# Altium project PCB_Project1.PrjPCB (part 2 of 2)

## Sheet Ctrol2.SchDoc
size A4
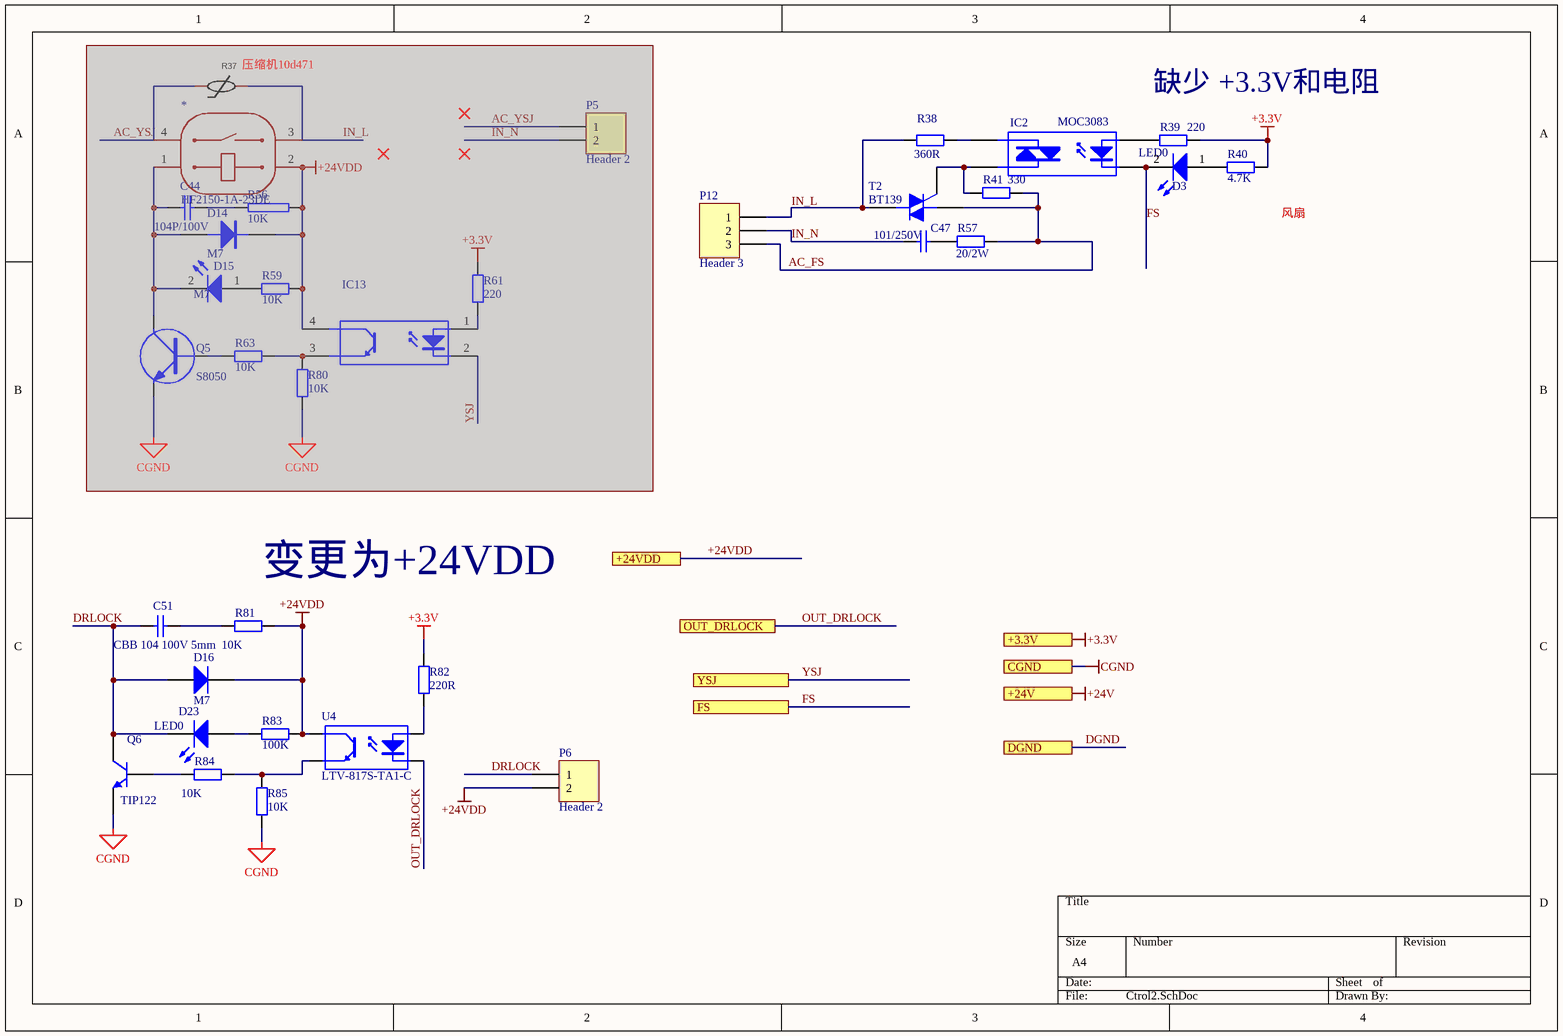
[diagram p14: Ctrol2.SchDoc]

### Parts
*  HF2150-1A-23DE  [JIDIANQI]  (masked out: inside a compile mask, not in the netlist)
C44  104P/100V  [CP1]  (masked out: inside a compile mask, not in the netlist)
C47  101/250V  [C6-7.62]
C51  CBB 104 100V 5mm  [CP1]
D3  LED0  [0805LED]
D14  M7  [SK24]  (masked out: inside a compile mask, not in the netlist)
D15  M7  [0805LED]  (masked out: inside a compile mask, not in the netlist)
D16  M7  [DO-214AC]
D23  LED0  [0805LED]
IC2  MOC3083  [DIP6]
IC13  (no value)  [TLV-356]  (masked out: inside a compile mask, not in the netlist)
P5  Header 2  [2P]  (masked out: inside a compile mask, not in the netlist)
P6  Header 2  [2P]
P12  Header 3  [CONN-TH_KF7.62-3p]
Q5  S8050  [SOT23]  (masked out: inside a compile mask, not in the netlist)
Q6  TIP122  [TO-220-AB]
R37  RM10D471KD14E100  [YAMINGDIANZU]  (value not drawn)  (masked out: inside a compile mask, not in the netlist)
R38  360R  [AXIAL0.4]
R39  220  [0805R]
R40  4.7K  [0805R]
R41  330  [AXIAL0.4]
R56  10K  [AXIAL0.4]  (masked out: inside a compile mask, not in the netlist)
R57  20/2W  [AXIAL0.6]
R59  10K  [0805R]  (masked out: inside a compile mask, not in the netlist)
R61  220  [0805R]  (masked out: inside a compile mask, not in the netlist)
R63  10K  [0805R]  (masked out: inside a compile mask, not in the netlist)
R80  10K  [0805R]  (masked out: inside a compile mask, not in the netlist)
R81  value 10K  [AXIAL0.4]  (hidden comment: 10K  1/2W)
R82  220R  [0805R]
R83  100K  [0805R]
R84  10K  [0805R]
R85  10K  [0805R]
T2  BT139  [TO220E]
U4  LTV-817S-TA1-C  [suo]

### Ports
+3.3V, +24V, +24VDD, CGND, DGND, FS, OUT_DRLOCK, YSJ

### Nets
+3.3V: R39.1 R40.2 R82.1 ; port +3.3V
+24VDD: D16.2(K) P6.2 R81.2 R83.1 U4.4(C) ; port +24VDD
CGND: Q6.3(E) R85.2 ; port CGND
AC_FS: P12.3 R41.2 R57.2 T2.1(M1)
DRLOCK: C51.2 D16.1(A) D23.2(K) P6.1 Q6.2(C)
FS: D3.2(K) IC2.2(K) ; port FS
IN_L: P12.1 R38.1 T2.2(M2)
IN_N: C47.1 P12.2
OUT_DRLOCK: U4.2(K) ; port OUT_DRLOCK
NetC47_2: C47.2 R57.1
NetC51_1: C51.1 R81.1
NetD3_1: D3.1(A) R40.1
NetD23_1: D23.1(A) R83.2
NetIC2_1: IC2.1(A) R39.2
NetIC2_4: IC2.4(A/K) R41.1 T2.3(G)
NetIC2_6: IC2.6(A/K) R38.2
NetQ6_1: Q6.1(B) R84.1
NetR82_2: R82.2 U4.1(A)
NetR84_2: R84.2 R85.1 U4.3(E)

### Notes on the sheet
- (near R37) 压缩机10d471
- 缺少 +3.3V和电阻
- (near R40) 风扇
- (near R81) 变更为+24VDD

### Library data of the parts
C44 = CAP: Capacitor
C47 = CAP: 品牌： SHM(南方宏明) 型号： DCF101K26Y5PQ6BL7A0 等级：X1,Y2 容值：100pF 精度：±10% 电压(AC)：250V；400V 安规瓷介电容器 Y2 101 ±10% Y2 250VAC；100pF；±10%；Y5P；D=6.8max；CP线 0.55mm；引脚长20min.mm；直脚/直引线；引线间距7.5mm; Manufacturer: Generic Components; Class: Passive; SubClass: Capacitor; Published: 08/06/2000; Publisher: Altium Hobart Technology Centre
C51 = Cap: Capacitor; Published: 8-Jun-2000; LatestRevisionDate: 17-Jul-2002; LatestRevisionNote: Re-released for DXP Platform.; PackageReference: RAD-0.3; Publisher: Altium Limited; PackageDescription: Radial Cap, Thru-Hole; 2 Leads; 0.3 in Pin Spacing; Value: CBB 104 100V 5mm
D3 = LED1: 品牌： 国星光电 型号： NCD0805B2 发光颜色：蓝灯 贴片LED；0805蓝色；2012蓝色；透镜颜色：无色透明；发光角度：130°；功率：72mW；工作温度：-30℃~+85℃；; Manufacturer: Generic Components; Class: Optoelectronic; SubClass: LED; Published: 08/06/2000; Publisher: Altium Hobart Technology Centre
D14 = DIODE
D15 = LED1: Typical RED GaAs LED; Manufacturer: Generic Components; Class: Optoelectronic; Published: 08/06/2000; Publisher: Altium Hobart Technology Centre; SubClass: LED
D16 = Diode 1N4004: 1 Amp General Purpose Rectifier; Published: 8-Jun-2000; LatestRevisionDate: 17-Jul-2002; LatestRevisionNote: Re-released for DXP Platform.; DatasheetVersion: 1998; PackageVersion: Aug-1999; PackageReference: DO-41; Publisher: Altium Limited; PackageDescription: Diode, Axial; Body 5.2 x 2.7 mm (LxDia. max), Lead Dia. 0.86 mm (max); Code_JEDEC: DO-204-AL; ComponentLink1Description: Manufacturer Link; ComponentLink1URL: http://www.fairchildsemi.com/; ComponentLink2Description: Datasheet; ComponentLink2URL: http://www.fairchildsemi.com/ds/1N%2F1N4001.pdf
D23 = LED0: Typical INFRARED GaAs LED; Published: 8-Jun-2000; LatestRevisionDate: 08-Jul-2005; LatestRevisionNote: Mech Layer 1 removed.; PackageReference: LED-0; Publisher: Altium Limited; PackageDescription: LED; 2 Leads
IC2 = OPTOTRIAC: 品牌： LITEON(光宝)   型号： MOC3083     可控硅类型：双向可控硅 正向电压：1.2V 正向电流：50mA 断态峰值电压(Vdrm)：800V 静态dv/dt：1500V/us
IC13 = OPTOISO1: Optoisolator
P5 P6 = Header 2: DG141V-2.54-2P; LatestRevisionDate: 17-Jul-2002; LatestRevisionNote: Re-released for DXP Platform.; Publisher: Altium Limited
P12 = Header 3: 品牌： KEFA(科发)  KF7.62-3p隔板类型：两面 间距：7.62mm 结构：1x2P 每排PIN数：2 排数：1 安装方式：直针 引脚位置：边脚 额定电流：24A 额定电压：450V 线规 - AWG：12~22 线规 - mm2：2.5 工作温度范围：-40℃~+105℃ 颜色：黑色 黑色; LatestRevisionDate: 17-Jul-2002; LatestRevisionNote: Re-released for DXP Platform.; Publisher: Altium Limited
Q5 = NPN: NPN Transistor
Q6 = 2N3904: 描述 / 互补功率达林顿晶体管 / 品牌名称 / ST(意法半导体) / 商品型号 / TIP122 / 商品编号 / C16283 / 商品封装 / TO-220-3; Published: 8-Jun-2000; LatestRevisionDate: 15-Jan-2003; LatestRevisionNote: PCB Footprint 'BCY-W3/D4.7' replaced; DatasheetVersion: 1997; PackageVersion: Sep-1998; PackageReference: TO-92A; Publisher: Altium Limited; PackageDescription: TO, Flat Index; 3 In-Line, Axial Leads; Body Dia. 4.5mm; Leads 0.51 x 0.48 mm (max); ComponentLink1Description: Manufacturer Link; ComponentLink1URL: http://www.fairchildsemi.com/; ComponentLink2Description: Datasheet; ComponentLink2URL: http://www.fairchildsemi.com/ds/2N%2F2N3904.pdf
R37 = RM10D471KD14E100: Manufacturer: Dersonic(德尔创); Add into BOM: yes; Varistor Voltage: 470V; Clamping Voltage: 775V; Allowable Voltage (DC): 385V; Allowable Voltage (AC): 300V; Peak Current: 2.5kA; Maximum Energy: 67J; Typical Capatitance: 210pF@1kHz; Rated Wattage: 400mW; Symbol: RM10D471KD14E100; Device: RM10D471KD14E100; LCSC Part Name: 钳位电压775V 67焦耳 插件压敏电阻; Supplier Part: C2974809; Manufacturer Part: RM10D471KD14E100; Supplier Footprint: 插件,P=7.5mm; JLCPCB Part Class: Extended Part; Datasheet: https://atta.szlcsc.com/upload/public/pdf/source/20220216/7E2B8E32815A179BCD41409596CBB68C.pdf; Supplier: LCSC; Convert to PCB: yes
R38 = RES2: 品牌： UNI-ROYAL(厚声) 型号： MFR0W4F3600A50电阻类型：金属膜电阻 阻值：360Ω 精度：±1% 功率：250mW 温度系数：±50ppm/℃ 铜脚，圆柱状直插 1/4W; Manufacturer: Generic Components; Class: Passive; SubClass: Resistor; Published: 08/06/2000; Publisher: Altium Hobart Technology Centre
R39 = RES2: 品牌： UNI-ROYAL(厚声) 型号： 0805W8F1500T5E ：电阻类型：厚膜电阻 阻值：150Ω 精度：±1% 功率：125mW 温度系数：±100ppm/℃; Manufacturer: Generic Components; Class: Passive; SubClass: Resistor; Published: 08/06/2000; Publisher: Altium Hobart Technology Centre
R40 = RES2: 品牌： UNI-ROYAL(厚声) 型号： 0805W8F3301T5E  电阻类型：厚膜电阻 阻值：3.3kΩ 精度：±1% 功率：125mW 温度系数：±100ppm/℃; Manufacturer: Generic Components; Class: Passive; SubClass: Resistor; Published: 08/06/2000; Publisher: Altium Hobart Technology Centre
R41 = RES2: 品牌： UNI-ROYAL(厚声) 型号： MFR0W4F3300A50 电阻类型：金属膜电阻 阻值：330Ω 精度：±1% 功率：250mW 温度系数：±50ppm/℃ 铜脚，圆柱状直插 1/4W; Manufacturer: Generic Components; Class: Passive; SubClass: Resistor; Published: 08/06/2000; Publisher: Altium Hobart Technology Centre
R56 = RES2
R57 = RES2: 品牌： 华星机电 型号： MF2WS-20Ω±1%T 电阻类型：金属膜电阻 阻值：20Ω 精度：±1% 功率：2W 温度系数：±200ppm/℃; Manufacturer: Generic Components; Class: Passive; SubClass: Resistor; Published: 08/06/2000; Publisher: Altium Hobart Technology Centre
R59 R61 R63 R80 = RES2: Resistor; Manufacturer: Generic Components; Class: Passive; Published: 08/06/2000; Publisher: Altium Hobart Technology Centre; SubClass: Resistor
R81 R82 R84 R85 = Res2: Resistor; Published: 8-Jun-2000; LatestRevisionDate: 17-Jul-2002; LatestRevisionNote: Re-released for DXP Platform.; PackageReference: AXIAL-0.4; Publisher: Altium Limited; PackageDescription: Axial Device, Thru-Hole; 2 Leads; 0.4 in Pin Spacing
  R82: Value: 220R
  R84 R85: Value: 10K
R83 = Res2: 牌: UNI-ROYAL(厚声) / 封装: 0805 / 电阻类型: 厚膜电阻 / 阻值: 100kΩ / 精度: ±1% / 功率: 125mW; Published: 8-Jun-2000; LatestRevisionDate: 17-Jul-2002; LatestRevisionNote: Re-released for DXP Platform.; PackageReference: AXIAL-0.4; Publisher: Altium Limited; PackageDescription: Axial Device, Thru-Hole; 2 Leads; 0.4 in Pin Spacing; Value: 100K
T2 = Triac: 品牌：FUXINSEMI(富芯森美) 型号： BT139-600E; Manufacturer: Generic Components; Class: Discrete; Note: Pin 2 is electrically connected to Pin 4 (TAB); Published: 29/09/2000; SubClass: TRIAC
U4 = TLP781: 描述 / LTV817C 贴片光耦 光电耦合 / 品牌名称 / LITEON(光宝) / 商品型号 / LTV-817S-TA1-C / 商品编号 / C109227 / 商品封装 / SMD-4P

## Sheet YL.SchDoc
size A4
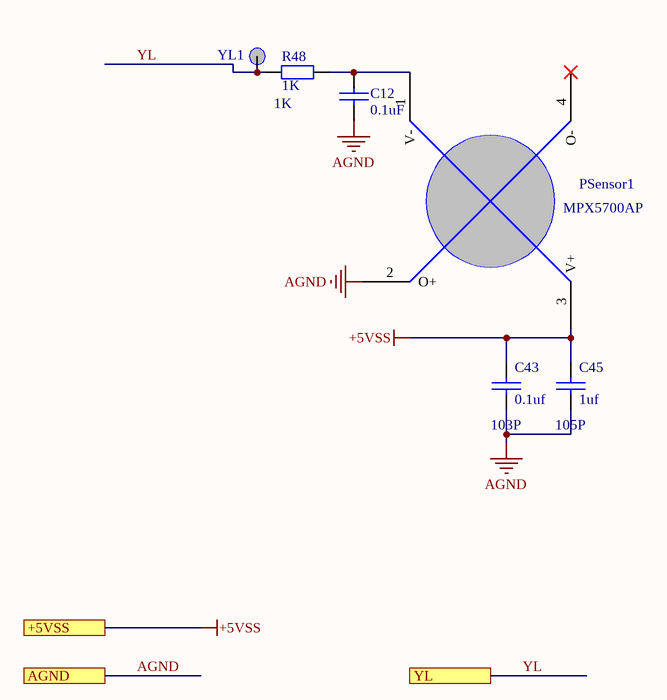
[diagram p15: YL.SchDoc]

### Parts
C12  0.1uF  [0805C]
C43  0.1uf  value 103P  [0805C]
C45  1uf  value 105P  [0805C]
PSensor1  MPX5700AP  [MPX5700AP]
R48  1K  [0805R]
YL1  (no value)  [TPP]

### Ports
+5VSS, AGND, YL

### Nets
+5VSS: C43.1 C45.2 PSensor1.3(V+) ; port +5VSS
AGND: C12.2 C43.2 C45.1 PSensor1.2(O+) ; port AGND
YL: R48.2 YL1.1 ; port YL
NetC12_1: C12.1 PSensor1.1(V-) R48.1

Not connected (* = marked no-connect by the designer): PSensor1 4(O-)*

### Library data of the parts
C12 = Cap
C43 C45 = Cap: Capacitor
PSensor1 = MPX
R48 = RES2: as R59 on sheet Ctrol2; Published: 08/06/2000; Publisher: Altium Hobart Technology Centre; SubClass: Resistor; Value: 1K
YL1 = TP

## Nets that join several sheets
+2.5Vref: POWER (6 pins), b1 (R23_b1.1 R26_b1.1), b2 (R23_b2.1 R26_b2.1), b3 (R23_b3.1 R26_b3.1)
+3.3V: main (P3.4 P4.17), POWER (C19.1 IC5.2), Input&messenger (R14.1 R15.1 R16.1), Designator3/d1 (R31_d1.1), Designator3/d2 (R31_d2.1), Designator3/d3 (R31_d3.1), Designator3/d4 (R31_d4.1), Designator3/d5 (R31_d5.1), messenger (C37.2 C38.2 U1.16), Light_Ctrol (7 pins), MCU_POWER (8 pins), Ctrol1,Ctrol2 (FM1.2), Designator/a1 (R88_a1.1 R93_a1.1), Designator/a2 (R88_a2.1 R93_a2.1), Ctrol2 (R39.1 R40.2 R82.1)
+5VSS: main (P4.11 P7.1 P7.3 P7.5), POWER (7 pins), b1 (C35_b1.2 IC10_b1.8), b2 (C35_b2.2 IC10_b2.8), b3 (C35_b3.2 IC10_b3.8), c1 (R28_c1.2), c2 (R28_c2.2), c3 (R28_c3.2), Hum_ADC (C30.2 IC9.8), YL (C43.1 C45.2 PSensor1.3)
+12V: main (P4.2), POWER (5 pins)
+24V: main (P4.13 P13.2 P14.2), POWER (7 pins), messenger (1.1)
+24VDD: POWER (B2.1 C22.1 E8.1 TP_1.1), Designator3/d1 (R30_d1.1), Designator3/d2 (R30_d2.1), Designator3/d3 (R30_d3.1), Designator3/d4 (R30_d4.1), Designator3/d5 (R30_d5.1), Ctrol1,Ctrol2 (P2.7), Designator/a1 (8 pins), Designator/a2 (8 pins), Ctrol2 (5 pins)
-5VSS: POWER (5 pins), b1 (C34_b1.2 IC10_b1.4), b2 (C34_b2.2 IC10_b2.4), b3 (C34_b3.2 IC10_b3.4), Hum_ADC (IC9.4)
AGND: main (P13.1 P14.1), POWER (28 pins), b1 (5 pins), b2 (5 pins), b3 (5 pins), MCU_POWER (5 pins), Hum_ADC (9 pins), Ctrol1,Ctrol2 (Q3.3 R49.2), YL (C12.2 C43.2 C45.1 PSensor1.2)
CGND: POWER (B2.4 C22.2 E8.2), Designator3/d1 (OP1_d1.2 R51_d1.2), Designator3/d2 (OP1_d2.2 R51_d2.2), Designator3/d3 (OP1_d3.2 R51_d3.2), Designator3/d4 (OP1_d4.2 R51_d4.2), Designator3/d5 (OP1_d5.2 R51_d5.2), Ctrol1,Ctrol2 (P2.8), Designator/a1 (Q9_a1.2 Q10_a1.2 R90_a1.1 R95_a1.1), Designator/a2 (Q9_a2.2 Q10_a2.2 R90_a2.1 R95_a2.1), Ctrol2 (Q6.3 R85.2)
DGND: main (5 pins), POWER (C19.2 E4.2 IC5.1), Designator3/d1 (OP1_d1.3), Designator3/d2 (OP1_d2.3), Designator3/d3 (OP1_d3.3), Designator3/d4 (OP1_d4.3), Designator3/d5 (OP1_d5.3), messenger (5 pins), Light_Ctrol (C27.1 IC8.1 IC8.4), MCU_POWER (11 pins), c1 (Q1_c1.2), c2 (Q1_c2.2), c3 (Q1_c3.2), Ctrol1,Ctrol2 (IC12.8)
ADC: main (*1.23), b1 (R25_b1.2)
ADC: main (*1.24), b2 (R25_b2.2)
ADC: main (*1.25), b3 (R25_b3.2)
ADC_Sense: main (P1.7), Hum_ADC (R20.2)
COMA: Ctrol1,Ctrol2 (P2.1), Designator/a1 (K1_a1.2 R87_a1.2), Designator/a2 (K1_a2.2 R87_a2.2)
COMB: Ctrol1,Ctrol2 (P2.4), Designator/a1 (K2_a1.2 R92_a1.2), Designator/a2 (K2_a2.2 R92_a2.2)
CONA1: Ctrol1,Ctrol2 (P2.2), Designator/a1 (K1_a1.3 R87_a1.1)
CONA2: Ctrol1,Ctrol2 (P2.3), Designator/a2 (K1_a2.3 R87_a2.1)
CONB1: Ctrol1,Ctrol2 (P2.5), Designator/a1 (K2_a1.3 R92_a1.1)
CONB2: Ctrol1,Ctrol2 (P2.6), Designator/a2 (K2_a2.3 R92_a2.1)
CTRL_DRLOCK: main (*1.40), Ctrol1,Ctrol2 (IC12.2)
CTRL_FMQ: main (*1.41), Ctrol1,Ctrol2 (R8.2)
CTRL_FS: main (*1.3), Ctrol1,Ctrol2 (IC12.1)
CTRL_RelayA1: main (*1.97), Ctrol1,Ctrol2 (IC12.7)
CTRL_RelayA2: main (*1.98), Ctrol1,Ctrol2 (IC12.6)
CTRL_RelayB1: main (*1.1), Ctrol1,Ctrol2 (IC12.5)
CTRL_RelayB2: main (*1.2), Ctrol1,Ctrol2 (IC12.4)
CTRL_YSJ: main (*1.5), Ctrol1,Ctrol2 (IC12.3)
EE_WP: main (*1.95), Light_Ctrol (IC8.7 R11.2)
FS: Ctrol1,Ctrol2 (IC12.16), Ctrol2 (D3.2 IC2.2)
GS_ADC: main (*1.30), Hum_ADC (C32.1 E11.1 R19.2 R52.2)
Hum_ADC1: main (*1.29), Hum_ADC (C29.1 E10.1 R17.2 R50.2)
Hum_Sense: main (P1.8), Hum_ADC (R18.2)
Input1: Input&messenger (*1.84), Designator3/d1 (OP1_d1.4 R31_d1.2)
Input2: Input&messenger (*1.85), Designator3/d2 (OP1_d2.4 R31_d2.2)
Input3: Input&messenger (*1.88), Designator3/d3 (OP1_d3.4 R31_d3.2)
Input4: Input&messenger (*1.57), Designator3/d4 (OP1_d4.4 R31_d4.2)
Input5: Input&messenger (*1.58), Designator3/d5 (OP1_d5.4 R31_d5.2)
OUT_DRLOCK: Ctrol1,Ctrol2 (IC12.15), Ctrol2 (U4.2)
PT_A1: main (P1.1), b1 (C33_b1.1 IC10_b1.1 R21_b1.1 R24_b1.1)
PT_A2: main (P1.3), b2 (C33_b2.1 IC10_b2.1 R21_b2.1 R24_b2.1)
PT_A3: main (P1.5), b3 (C33_b3.1 IC10_b3.1 R21_b3.1 R24_b3.1)
PT_B1: main (P1.2), b1 (C33_b1.2 IC10_b1.2 R21_b1.2 R23_b1.2)
PT_B2: main (P1.4), b2 (C33_b2.2 IC10_b2.2 R21_b2.2 R23_b2.2)
PT_B3: main (P1.6), b3 (C33_b3.2 IC10_b3.2 R21_b3.2 R23_b3.2)
RelayA1: Ctrol1,Ctrol2 (IC12.10), Designator/a1 (OP2_a1.2)
RelayA2: Ctrol1,Ctrol2 (IC12.11), Designator/a2 (OP2_a2.2)
RelayB1: Ctrol1,Ctrol2 (IC12.12), Designator/a1 (OP3_a1.2)
RelayB2: Ctrol1,Ctrol2 (IC12.13), Designator/a2 (OP3_a2.2)
RXD2: Input&messenger (*1.87), messenger (U1.9)
RXD3: Input&messenger (*1.56), messenger (U1.12)
SCLK: main (*1.92 P4.1), Light_Ctrol (IC8.6 R12.2)
SDA: main (*1.93 P4.3), Light_Ctrol (IC8.5 R13.2)
SI_A1: Input&messenger (P10.10), Designator3/d1 (R30_d1.2)
SI_A2: Input&messenger (P10.8), Designator3/d2 (R30_d2.2)
SI_A3: Input&messenger (P10.6), Designator3/d3 (R30_d3.2)
SI_A4: Input&messenger (P10.4), Designator3/d4 (R30_d4.2)
SI_A5: Input&messenger (P10.2), Designator3/d5 (R30_d5.2)
SI_B1: Input&messenger (P10.9), Designator3/d1 (OP1_d1.1 R51_d1.1)
SI_B2: Input&messenger (P10.7), Designator3/d2 (OP1_d2.1 R51_d2.1)
SI_B3: Input&messenger (P10.5), Designator3/d3 (OP1_d3.1 R51_d3.1)
SI_B4: Input&messenger (P10.3), Designator3/d4 (OP1_d4.1 R51_d4.1)
SI_B5: Input&messenger (P10.1), Designator3/d5 (OP1_d5.1 R51_d5.1)
SSR1: main (*1.63), c1 (R29_c1.1)
SSR2: main (*1.64), c2 (R29_c2.1)
SSR3: main (*1.65), c3 (R29_c3.1)
SSR-1: main (P7.2), c1 (D11_c1.2 Q1_c1.3)
SSR-2: main (P7.4), c2 (D11_c2.2 Q1_c2.3)
SSR-3: main (P7.6), c3 (D11_c3.2 Q1_c3.3)
TXD2: Input&messenger (*1.86), messenger (U1.10)
TXD3: Input&messenger (*1.55), messenger (U1.11)
YL: main (*1.32), YL (R48.2 YL1.1)